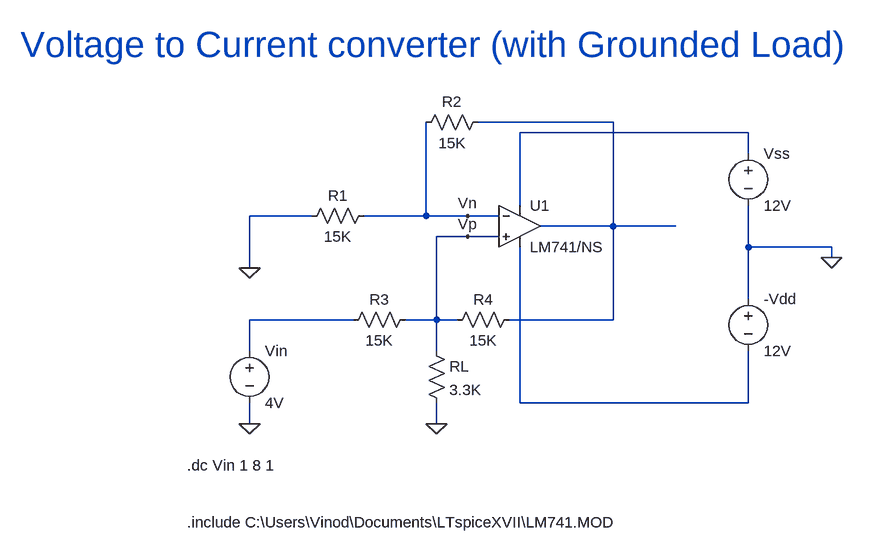
[diagram p0: schematic Vi-Converter Current Source.asc]
Vi-Converter Current Source.asc, the LTspice schematic file:
Version 4
SHEET 1 880 680
WIRE 336 0 128 0
WIRE 544 16 192 16
WIRE 544 48 544 16
WIRE 192 128 192 16
WIRE -128 144 -224 144
WIRE 48 144 48 0
WIRE 48 144 -48 144
WIRE 112 144 48 144
WIRE 160 144 112 144
WIRE 336 160 336 0
WIRE 336 160 224 160
WIRE 432 160 336 160
WIRE 112 176 64 176
WIRE 160 176 112 176
WIRE 544 192 544 128
WIRE 672 192 544 192
WIRE 672 208 672 192
WIRE -224 224 -224 144
WIRE 544 272 544 192
WIRE -64 304 -224 304
WIRE 64 304 64 176
WIRE 64 304 16 304
WIRE 96 304 64 304
WIRE 336 304 336 160
WIRE 336 304 176 304
WIRE -224 352 -224 304
WIRE 64 352 64 304
WIRE 192 432 192 192
WIRE 544 432 544 352
WIRE 544 432 192 432
WIRE -224 464 -224 432
WIRE 64 464 64 432
FLAG 672 208 0
FLAG -224 224 0
FLAG -224 464 0
FLAG 64 464 0
FLAG 112 144 Vn
FLAG 112 176 Vp
SYMBOL res 144 -16 R90
WINDOW 0 0 56 VBottom 2
WINDOW 3 32 56 VTop 2
SYMATTR InstName R2
SYMATTR Value 15K
SYMBOL res -32 128 R90
WINDOW 0 0 56 VBottom 2
WINDOW 3 32 56 VTop 2
SYMATTR InstName R1
SYMATTR Value 15K
SYMBOL res 32 288 R90
WINDOW 0 0 56 VBottom 2
WINDOW 3 32 56 VTop 2
SYMATTR InstName R3
SYMATTR Value 15K
SYMBOL res 192 288 R90
WINDOW 0 0 56 VBottom 2
WINDOW 3 32 56 VTop 2
SYMATTR InstName R4
SYMATTR Value 15K
SYMBOL voltage 544 32 R0
SYMATTR InstName Vss
SYMATTR Value 12V
SYMBOL voltage 544 256 R0
SYMATTR InstName -Vdd
SYMATTR Value 12V
SYMBOL voltage -224 336 R0
WINDOW 123 0 0 Left 0
WINDOW 39 0 0 Left 0
SYMATTR InstName Vin
SYMATTR Value 4V
SYMBOL res 48 336 R0
SYMATTR InstName RL
SYMATTR Value 3.3K
SYMBOL OpAmps\\opamp2 192 96 R0
SYMATTR InstName U1
SYMATTR Value LM741/NS
TEXT -320 528 Left 2 !.dc Vin 1 8 1
TEXT -320 616 Left 2 !.include C:\\Users\\Vinod\\Documents\\LTspiceXVII\\LM741.MOD
TEXT -576 -120 Left 5 ;Voltage to Current converter (with Grounded Load)

The netlist it stands for:
* Vi-Converter Current Source.asc
R2 N001 Vn 15K
R1 Vn 0 15K
R3 Vp N003 15K
R4 N001 Vp 15K
Vss N002 0 12V
V§-Vdd 0 N004 12V
Vin N003 0 4V
RL Vp 0 3.3K
XU1 Vp Vn N002 N004 N001 LM741/NS  ; pins In+ In- V+ V- OUT
.dc Vin 1 8 1
.include C:\Users\Vinod\Documents\LTspiceXVII\LM741.MOD
* Voltage to Current converter (with Grounded Load)
.backanno
.end